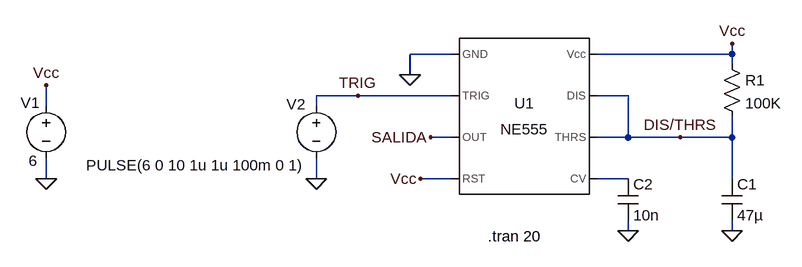
[diagram p0: schematic ne555-monoestable.asc]
ne555-monoestable.asc, the LTspice schematic file:
Version 4
SHEET 1 880 680
WIRE 80 80 16 80
WIRE 512 80 512 64
WIRE 512 80 304 80
WIRE 512 96 512 80
WIRE 16 112 16 80
WIRE -64 144 -128 144
WIRE 80 144 -64 144
WIRE 352 144 304 144
WIRE -544 160 -544 128
WIRE -128 160 -128 144
WIRE 80 208 48 208
WIRE 352 208 352 144
WIRE 352 208 304 208
WIRE 432 208 352 208
WIRE 512 208 512 176
WIRE 512 208 432 208
WIRE -544 272 -544 240
WIRE -128 272 -128 240
WIRE 80 272 32 272
WIRE 352 272 304 272
WIRE 512 272 512 208
WIRE 352 352 352 336
WIRE 512 352 512 336
FLAG -544 272 0
FLAG 352 352 0
FLAG -544 128 Vcc
FLAG 32 272 Vcc
FLAG 48 208 SALIDA
FLAG 16 112 0
FLAG 512 64 Vcc
FLAG 512 352 0
FLAG -128 272 0
FLAG -64 144 TRIG
FLAG 432 208 DIS/THRS
SYMBOL Misc\\NE555 192 176 R0
SYMATTR InstName U1
SYMBOL voltage -544 144 R0
WINDOW 123 0 0 Left 0
WINDOW 39 0 0 Left 0
WINDOW 0 -39 11 Left 2
WINDOW 3 -27 100 Left 2
SYMATTR InstName V1
SYMATTR Value 6
SYMBOL res 496 80 R0
SYMATTR InstName R1
SYMATTR Value 100K
SYMBOL cap 336 272 R0
SYMATTR InstName C2
SYMATTR Value 10n
SYMBOL cap 496 272 R0
SYMATTR InstName C1
SYMATTR Value 47µ
SYMBOL voltage -128 144 R0
WINDOW 0 -46 13 Left 2
WINDOW 3 -354 107 Left 2
WINDOW 123 0 0 Left 0
WINDOW 39 0 0 Left 0
SYMATTR InstName V2
SYMATTR Value PULSE(6 0 10 1u 1u 100m 0 1)
TEXT 136 360 Left 2 !.tran 20

The netlist it stands for:
* ne555-monoestable.asc
XU1 0 TRIG SALIDA Vcc N001 DIS/THRS DIS/THRS Vcc NE555  ; pins GND TRIG OUT RST CV THRS DIS Vcc
V1 Vcc 0 6
R1 Vcc DIS/THRS 100K
C2 N001 0 10n
C1 DIS/THRS 0 47µ
V2 TRIG 0 PULSE(6 0 10 1u 1u 100m 0 1)
.tran 20
.lib NE555.sub
.backanno
.end